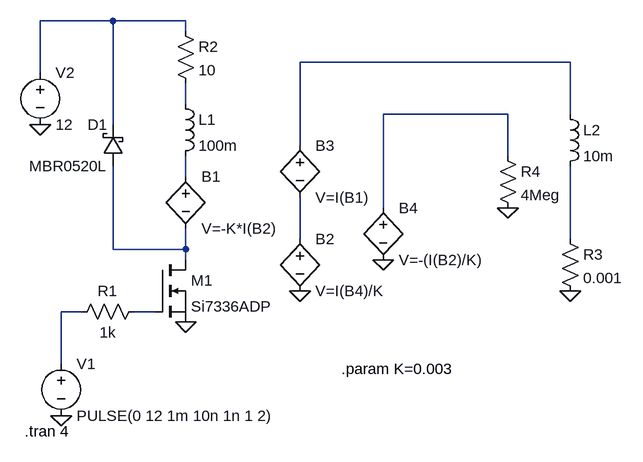
[diagram p0: schematic Draft2.asc]
Draft2.asc, the LTspice schematic file:
Version 4
SHEET 1 880 680
WIRE -240 -64 -352 -64
WIRE -128 -64 -240 -64
WIRE -128 -48 -128 -64
WIRE 464 0 48 0
WIRE -352 16 -352 -64
WIRE -128 64 -128 32
WIRE 368 80 176 80
WIRE 464 80 464 0
WIRE -240 96 -240 -64
WIRE 48 128 48 0
WIRE 368 144 368 80
WIRE -128 176 -128 144
WIRE 176 224 176 80
WIRE 48 272 48 208
WIRE 464 272 464 160
WIRE -240 288 -240 160
WIRE -128 288 -128 256
WIRE -128 288 -240 288
WIRE -128 304 -128 288
WIRE -288 384 -320 384
WIRE -176 384 -208 384
WIRE -320 464 -320 384
FLAG -320 544 0
FLAG -352 96 0
FLAG -128 400 0
FLAG 464 352 0
FLAG 48 352 0
FLAG 176 304 0
FLAG 368 224 0
SYMBOL nmos -176 304 R0
SYMATTR InstName M1
SYMATTR Value Si7336ADP
SYMBOL voltage -320 448 R0
WINDOW 123 0 0 Left 0
WINDOW 39 0 0 Left 0
SYMATTR InstName V1
SYMATTR Value PULSE(0 12 1m 10n 1n 1 2)
SYMBOL res -192 368 R90
WINDOW 0 0 56 VBottom 2
WINDOW 3 32 56 VTop 2
SYMATTR InstName R1
SYMATTR Value 1k
SYMBOL ind -144 48 R0
SYMATTR InstName L1
SYMATTR Value 100m
SYMBOL res -144 -64 R0
SYMATTR InstName R2
SYMATTR Value 10
SYMBOL voltage -352 0 R0
WINDOW 123 0 0 Left 0
WINDOW 39 0 0 Left 0
SYMATTR InstName V2
SYMATTR Value 12
SYMBOL bv -128 160 R0
SYMATTR InstName B1
SYMATTR Value V=-K*I(B2)
SYMBOL schottky -224 160 R180
WINDOW 0 24 64 Left 2
WINDOW 3 24 0 Left 2
SYMATTR InstName D1
SYMATTR Value MBR0520L
SYMATTR Description Diode
SYMATTR Type diode
SYMBOL bv 48 256 R0
SYMATTR InstName B2
SYMATTR Value V=I(B4)/K
SYMBOL res 448 256 R0
SYMATTR InstName R3
SYMATTR Value 0.001
SYMBOL ind 448 64 R0
SYMATTR InstName L2
SYMATTR Value 10m
SYMBOL bv 48 112 R0
SYMATTR InstName B3
SYMATTR Value V=I(B1)
SYMBOL bv 176 208 R0
SYMATTR InstName B4
SYMATTR Value V=-(I(B2)/K)
SYMBOL res 352 128 R0
SYMATTR InstName R4
SYMATTR Value 4Meg
TEXT -376 568 Left 2 !.tran 4
TEXT 112 472 Left 2 !.param K=0.003

The netlist it stands for:
* Draft2.asc
M1 N008 N010 0 0 Si7336ADP
V1 N009 0 PULSE(0 12 1m 10n 1n 1 2)
R1 N010 N009 1k
L1 N003 N005 100m
R2 N001 N003 10
V2 N001 0 12
B1 N005 N008 V=-K*I(B2)
D1 N008 N001 MBR0520L
B2 N006 0 V=I(B4)/K
R3 N007 0 0.001
L2 N002 N007 10m
B3 N002 N006 V=I(B1)
B4 N004 0 V=-(I(B2)/K)
R4 N004 0 4Meg
.model D D
.lib standard.dio
.model NMOS NMOS
.model PMOS PMOS
.lib standard.mos
.tran 4
.param K=0.003
.backanno
.end